# EAGLE design Power Board (EAGLE 9.3.0)
AUTHOR: Itay Shtainberg
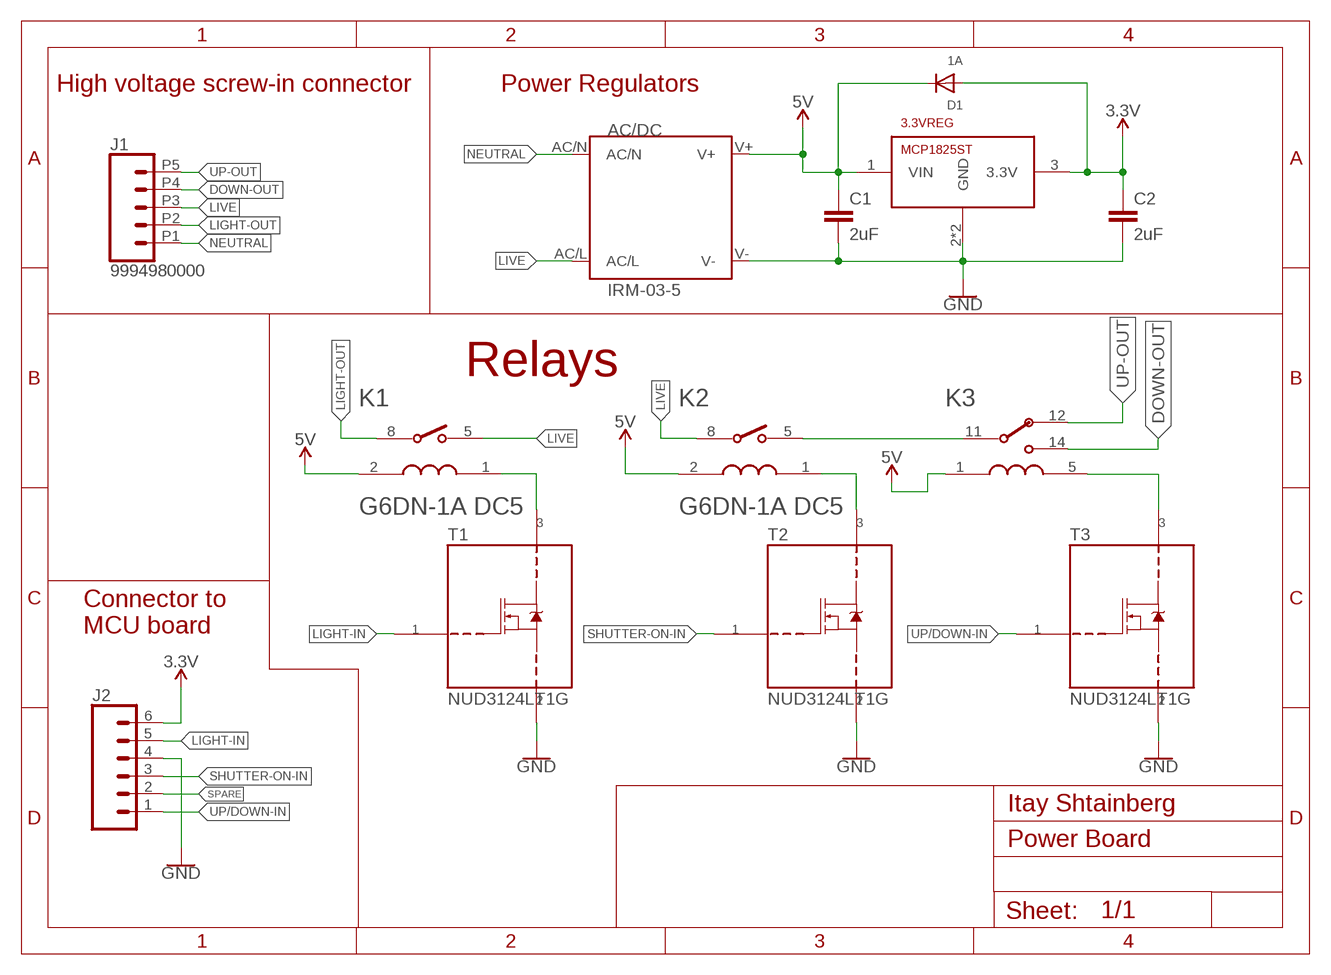
[diagram p0: schematic, sheet 1]

## Parts
3.3VREG  MCP1825ST  MCP1825ST-3302E/DB  [SOT223]
AC/DC  IRM-03-5  IRM_03IRM_03  [IRM_03]
C1  2uF  C  [C0805]
C2  2uF  C  [C0805]
D1  1A  DIODESOD-123  [SOD-123]
J1  9994980000  [9994980000]
J2  CONN_06FEMALE_LOCK  [1X06_FEMALE_LOCK.010]
K1  G6DN-1A-L DC5  OMRON_G6DN-1A_DC5OMRON_G6DN-1A_DC5_0_0  [OMRON_G6DN-1A_DC5_0]
K2  G6DN-1A-L DC5  OMRON_G6DN-1A_DC5OMRON_G6DN-1A_DC5_0_0  [OMRON_G6DN-1A_DC5_0]
K3  PE014005  [RELAY5-PE_CO]
T1  NUD3124LT1G  [SOT23]
T2  NUD3124LT1G  [SOT23]
T3  NUD3124LT1G  [SOT23]

## Nets
3.3V: 3.3VREG.3(3.3V) C2.1 D1.A J2.6
5V: 3.3VREG.1(VIN) AC/DC.V+ C1.1 D1.C K1.2 K2.2 K3.1(COIL1)
DOWN-OUT: J1.P4 K3.14(NO)
GND: 3.3VREG.2(GND) 3.3VREG.4(GND) AC/DC.V- C1.2 C2.2 J2.4 T1.2 T2.2 T3.2
LIGHT-IN: J2.5 T1.1
LIGHT-OUT: J1.P2 K1.8
LIVE: AC/DC.AC/L J1.P3 K1.5 K2.8
N$1: K2.5 K3.11(P)
N$3: K1.1 T1.3
N$5: K3.5(COIL2) T3.3
N$6: K2.1 T2.3
NEUTRAL: AC/DC.AC/N J1.P1
SHUTTER-ON-IN: J2.3 T2.1
SPARE: J2.2
UP-OUT: J1.P5 K3.12(NC)
UP/DOWN-IN: J2.1 T3.1

## Notes on the sheet
- High voltage screw-in connector | Power Regulators
- Relays
- Connector to
  MCU board

## Library data of the parts
3.3VREG = boilerparts:MCP1825ST-3302E/DB
AC/DC = meanwell_irm_v7:IRM_03: 3 watt IRM 03 Vout [V] Imax [A] Pmax [W] Eff [%] 3.3 0.9 3 68 5 0.6 3 72 9 0.33 3 77 12 0.25 3 78 15 0.2 3 78 24 0.125 3 80
C1 C2 = eagle-ltspice:C: CAPACITOR, European symbol; SPICEMODEL: NONE; SPICEPREFIX: C
D1 = adafruit:DIODE: Diode SMADIODE - SMA Surface Mount Package 20V 1A Schottky Diode Digikey: 641-1014-6-ND DO-1N4148 - Through Hole Small Current Diode SOD-123 20V 1 A (.5mV Vf) Schottky Diode - Digikey: MBRX120TPMSCT-ND SOD-323 10V 570mA (.38mV Vf, 3ns) Schottky Diode - Digikey: ZLLS410CT-ND SOD-523 30V 30mA Schottky Diode (RB751S-40TE61) - Digikey: RB751S-40TE61CT-ND SOT23-R/W - SOT23 Package (R = Solder Paste/Reflow Ovens, W = Hand-Soldering) BAT54Film 40V 300mA - Digikey: 497-7162-1-ND
J1 = Weidmuller 9994980000 :9994980000
J2 = SparkFun-Connectors:CONN_06: Multi connection point. Often used as Generic Header-pin footprint for 0.1 inch spaced/style header connections On any of the 0.1 inch spaced packages, you can populate with these: Break Away Headers - Straight <https://www.sparkfun.com/products/116> (PRT-00116) Break Away Male Headers - Right Angle <https://www.sparkfun.com/products/553> (PRT-00553) Female Headers <https://www.sparkfun.com/products/115> (PRT-00115) Break Away Headers - Machine Pin <https://www.sparkfun.com/products/117> (PRT-00117) Break Away Female Headers - Swiss Machine Pin <https://www.sparkfun.com/products/743> (PRT-00743) Arduino Stackable Header - 6 Pin <https://www.sparkfun.com/products/9280> (PRT-09280) For SCREWTERMINALS and SPRING TERMINALS visit here: Screw Terimnals on SparkFun.com <https://www.sparkfun.com/search/results?term=Screw+Terminals> (5mm/3.5mm/2.54mm spacing) This device is also useful as a general connection point to wire up your design to another part of your project. Our various solder wires solder well into these plated through hole pads. Hook-Up Wire - Assortment (Stranded, 22 AWG) <https://www.sparkfun.com/products/11375> (PRT-11375) Hook-Up Wire - Assortment (Solid Core, 22 AWG) <https://www.sparkfun.com/products/11367> (PRT-11367) View the entire wire category on our website here <https://www.sparkfun.com/categories/141>
K1 K2 = Omron - G6DN-1A DC5:OMRON_G6DN-1A_DC5: General Purpose Relays 1 Form A w/ 5VDC 5A, EN61010-2-201; CENTROID_NOT_SPECIFIED: No; DATASHEET: http://omronfs.omron.com/en_US/ecb/products/pdf/en-g6dn.pdf; DIGIKEY_DESCRIPTION: RELAY GEN PURPOSE SPST 5A 5V; DIGIKEY_PART_NUMBER: Z5439-N; LEAD_FREE: yes; MF: Omron; MOUSER_PART_NUMBER: 653-G6DN1ADC5; MPN: G6DN-1A DC5; PACKAGE: RELAY_TH; PREFIX: K; ROHS: yes; TEMPERATURE_RANGE_HIGH: +90°C; TEMPERATURE_RANGE_LOW: -40°C
K3 = SCHRACK-PE014005 :PE014005; BUILT_BY: EMA_UL_Team; COPYRIGHT: Copyright (C) 2016 Accelerated Designs. All rights reserved; MANUFACTURER_PART_NUMBER: PE014005; VENDOR: TE Connectivity
T1-T3 = NUD3124LT1G :NUD3124LT1G

## Board
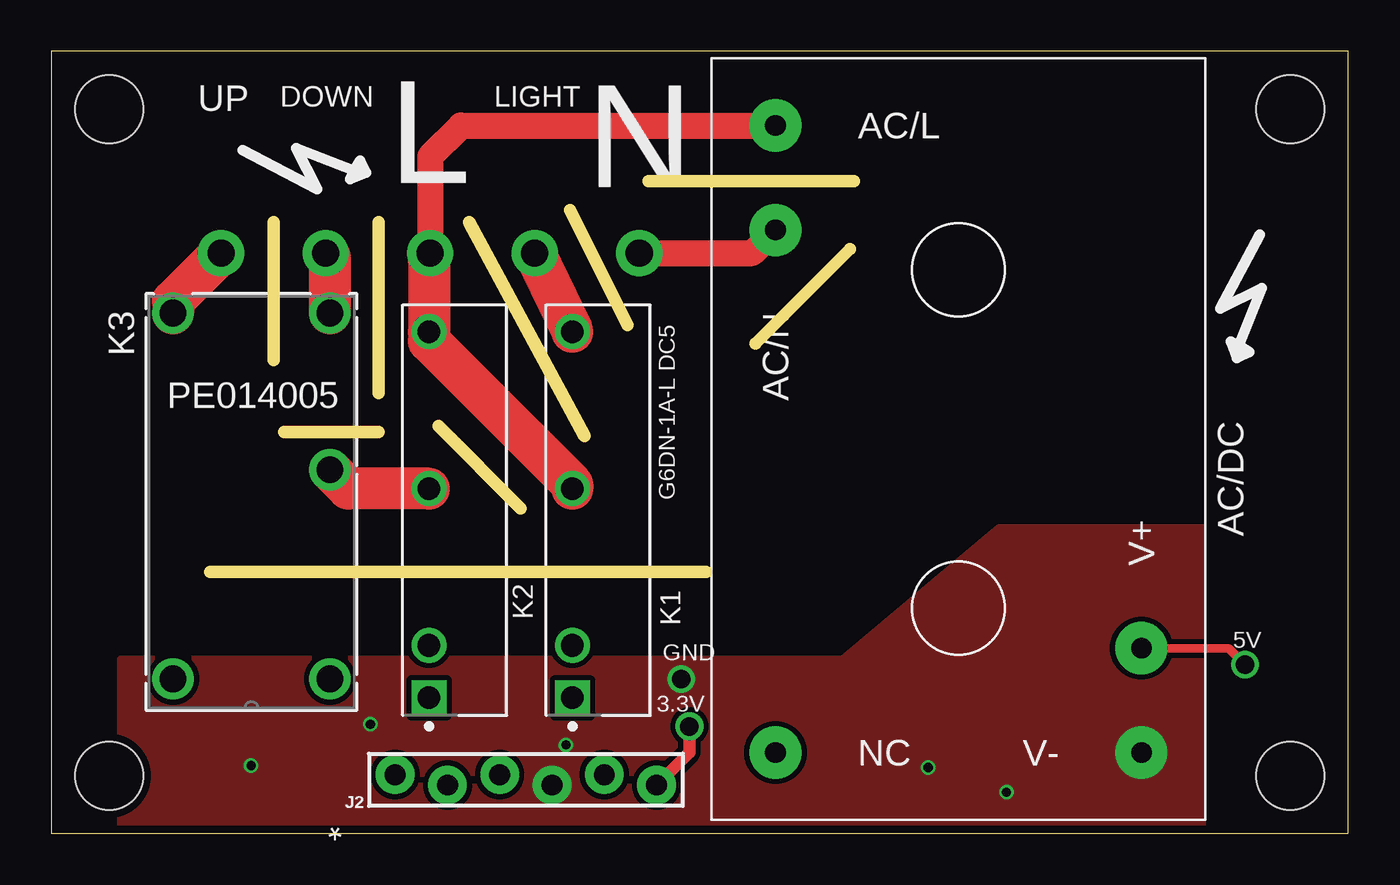
[diagram p1: board, top side]
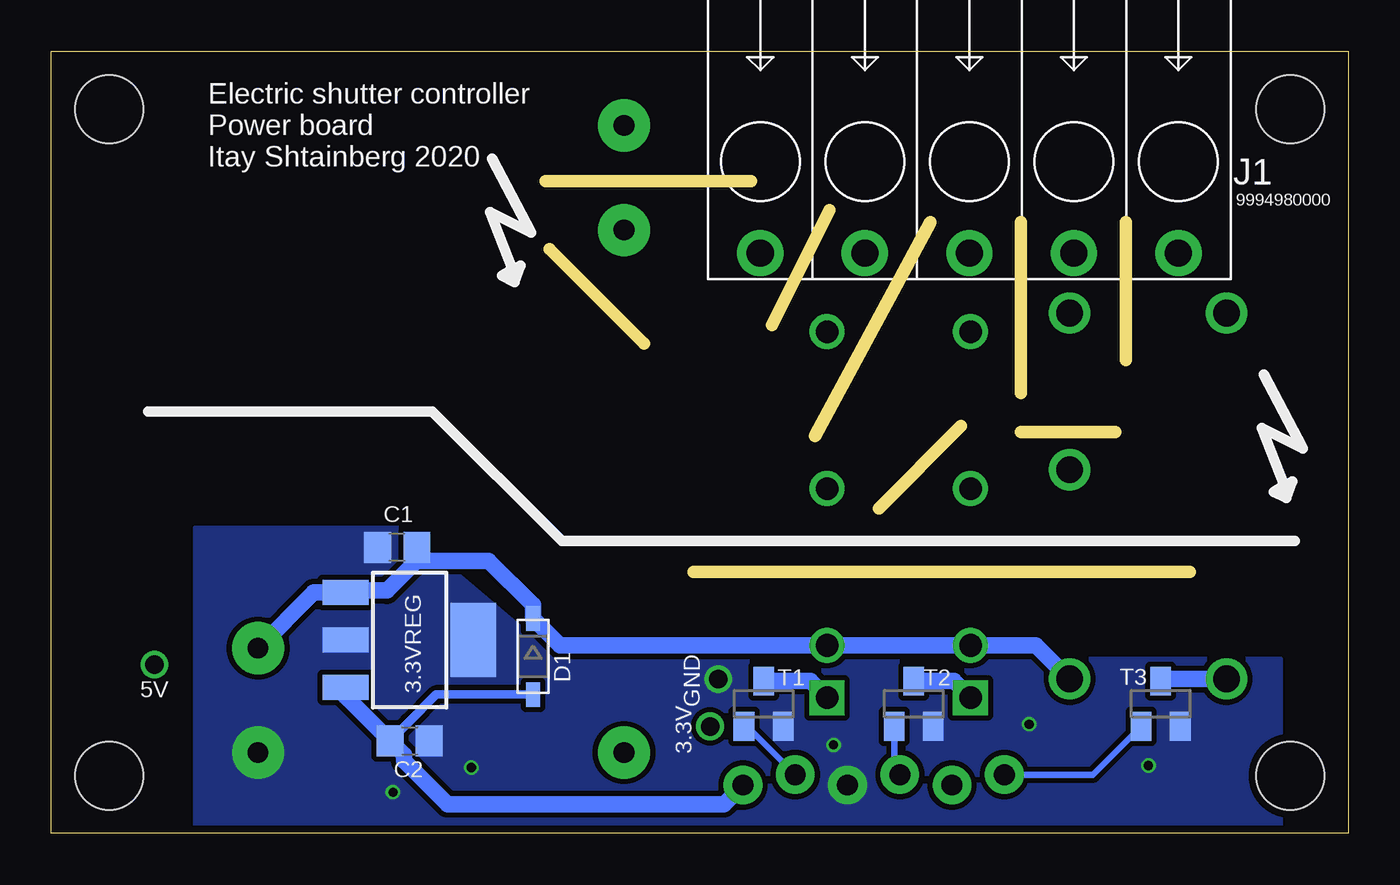
[diagram p2: board, bottom side, seen from below]

Size 63 x 38 mm. Coordinates in mm from the lower left corner, seen from the top.
Outline: 39,31.7 29,31.7
Outline: 25.2,30.3 28,24.7
Outline: 20.3,29.7 25.9,19.3
Outline: 15.9,29.7 15.9,21.4
Outline: 18.8,19.8 22.8,15.8
Outline: 10.8,29.7 10.8,23
Outline: 7.7,12.7 31.8,12.7
Outline: 34.2,23.8 38.8,28.4
Outline: 15.9,19.5 11.3,19.5
Outline: 63,38 0,38 0,0 63,0 63,38
Copper layers (1*16): Top 0.035559375mm / dielectric 1.6mm / Bottom 0.035559375mm
Design rules "oshpark-2layer": minimum track width 6mil, minimum drill 10mil, track to track 6mil, track to pad 6mil, pad to pad 6mil, via to via 6mil, smd to smd 6mil, copper to edge 15mil, drill to drill 6mil, minimum pad ring 5mil, minimum via ring 5mil, stop-mask expansion 2.5mil, vias tented up to drill 0mil, thermal gap 10mil
Holes 3.3 mm at 2.8,35.2 2.8,2.8 60.2,35.2 60.2,2.8
Milling: 9 lines

### Footprints (pad centres in the part's own frame; a part is rotated, then mirrored left to right if it is on the bottom)
SOT223 = smd 1.219 x 2.235: 1 -2.311,-3.099; 2 0,-3.099; 3 2.311,-3.099 | smd 3.6 x 2.2: 4 0,3.099
IRM_03 = drill 1 pad 2.54: AC/L -15.24,-8.89; AC/N -10.16,-8.89; NC 15.24,-8.89; V+ 10.16,8.89; V- 15.24,8.89
C0805 = smd 1.3 x 1.5: 1 -0.95,0; 2 0.95,0
SOD-123 = smd 1.2 x 0.7: A 1.85,0; C -1.85,0
9994980000 = drill 1.32 pad 2.25: P1 10.16,0; P2 5.08,0; P3 0,0; P4 -5.08,0; P5 -10.16,0
1X06_FEMALE_LOCK.010 = drill 1.016 pad 1.88: 1 0,0.254; 2 2.54,-0.254; 3 5.08,0.254; 4 7.62,-0.254; 5 10.16,0.254; 6 12.7,-0.254
OMRON_G6DN-1A_DC5_0 = drill 1.1 pad 1.7 square: 1 -9.115,1.245 | drill 1.1 pad 1.7: 2 -6.575,1.245; 5 1.045,1.245; 8 8.665,1.245
RELAY5-PE_CO = drill 1.295 pad 2.007: 1 -7.62,17.196; 5 0,17.196; 11 -7.62,7.036; 12 0,-0.584; 14 -7.62,-0.584
SOT23 = smd 1 x 1.4: 1 -0.95,-1.1; 2 0.95,-1.1; 3 0,1.1

### Placement (x,y rotation side)
3.3VREG  45.6,9.4 270 bottom
AC/DC  44.07,19.16 270 top
C1  46.2,13.9 180 bottom
C2  45.6,4.5 0 bottom
D1  39.6,8.6 270 bottom
J1  18.4,28.2 180 bottom
J2  16.7,2.6 0 top
K1  26.56,15.71 90 top
K2  19.59,15.71 90 top
K3  5.91,24.7 180 top
T1  28.4,6.3 0 bottom
T2  21.1,6.3 0 bottom
T3  9.1,6.3 0 bottom

### Tracks (layer width: path | path; a pad name or v marks a point on that pad's centre or on a via)
3.3V  (via drill 0.9)
  Top 0.61: J2.6 31,3.95 v31,5.2
  Bottom 0.406: C2.1 45.66,5.39 45.66,5.4 44.3,6.75 D1.A
  Bottom 0.813: 3.3VREG.3 48.7,6.65 C2.1 45.86,3.81 45.86,3.52 43.76,1.42 30.32,1.42 J2.6
5V  (via drill 0.9)
  Top 0.406: AC/DC.V+ 57.2,9 v58,8.2
  Bottom 0.813: 45.25,13.25 46.7,11.8 48.61,11.8 3.3VREG.1 50.25,11.71 AC/DC.V+ | 45.25,13.25 C1.1 | 45.25,13.25 41.75,13.25 39.6,11.1 D1.C 38.28,9.13 K1.2 K2.2 15.16,9.13 K3.1
DOWN-OUT
  Top 2.032: K3.14 13.53,27.99 J1.P4
GND  (via drill 0.45, 0.9)
  other vias: 30.6,7.5 9.7,3.3 15.5,5.3 25,4.3 42.6,3.2 46.4,2
  pour Bottom (isolate 0.254, no thermals): 56,0 56,14.84 45.97,14.86 38.4,8.49 3.3,8.5 3.3,0
  pour Top (isolate 0.254, no thermals): 56,-0.3 56,14.9 46.02,14.9 38.4,8.5 3.3,8.5 3.3,-0.3
LIGHT-IN
  Bottom 0.305: T1.1 29.21,5.2 J2.5
LIGHT-OUT
  Top 2.032: J1.P2 K1.8
LIVE
  Top 1.27: AC/DC.AC/L 19.9,34.4 18.4,32.9 J1.P3 18.4,27.9 18.34,27.84
  Top 2.032: 18.34,27.84 K2.8 18.34,23.93 25.32,16.95 K1.5
N$1
  Top 2.032: K2.5 14.44,16.75 K3.11
N$3
  Bottom 0.813: K1.1 26.12,7.4 T1.3
N$5
  Bottom 0.813: T3.3 9,7.5 K3.5
N$6
  Bottom 0.813: T2.3 19.15,7.4 K2.1
NEUTRAL
  Top 1.27: AC/DC.AC/N 34.06,28.2 J1.P1
SHUTTER-ON-IN
  Bottom 0.305: T2.1 22.05,3.12 J2.3
UP-OUT
  Top 2.032: J1.P5 5.91,25.87 K3.12
UP/DOWN-IN
  Bottom 0.305: T3.1 12.4,2.85 J2.1

### Text on the board
tNames: UP | DOWN | LIGHT | L | N | G6DN-1A-L DC5 | 5V | GND | 3.3V
bNames: Electric shutter controller / Power board / Itay Shtainberg 2020 | GND | 5V | 3.3V